# Altium schematic sheet S01.SchDoc: DQLA-F   FPGA Interface Board
size 381 x 254 mm; Revision: 1.1; SheetNumber: 1; SheetTotal: 1
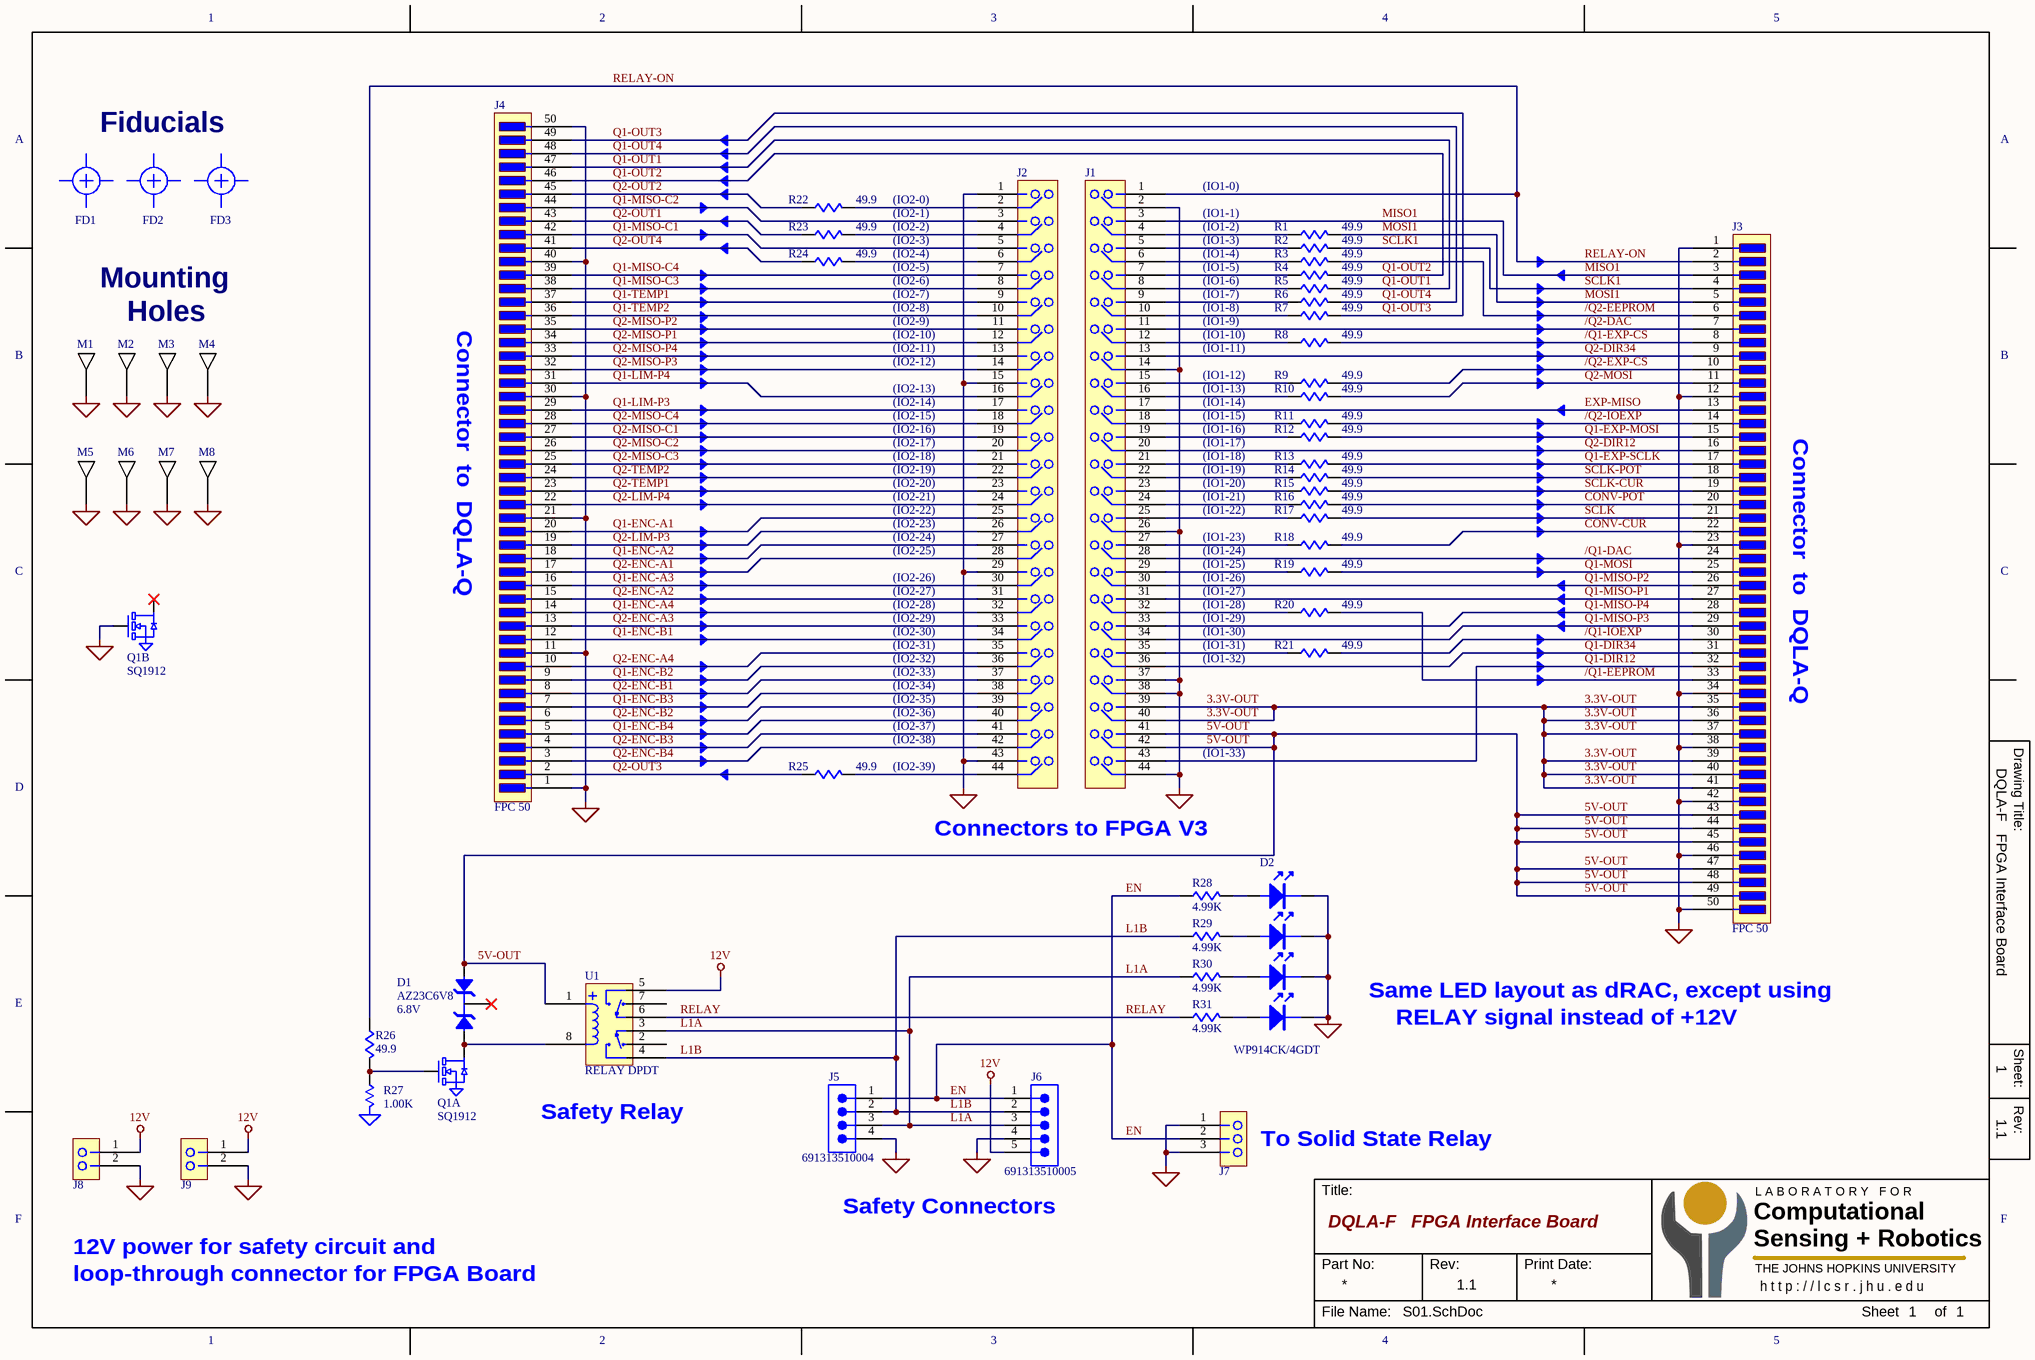
[diagram p0: S01.SchDoc]

## Parts
D1  AZ23C6V8  Voltage: 6.8V  [SOT-23]
D2  WP914CK/4GDT  [LED-3MM-QUAD]
FD1  FD  [FD]  (value not drawn)  (no BOM)
FD2  FD  [FD]  (value not drawn)  (no BOM)
FD3  FD  [FD]  (value not drawn)  (no BOM)
J1  HEADER 22x2-1  [HDR-22x2-2MM]  (value not drawn)
J2  HEADER 22x2-1  [HDR-22x2-2MM]  (value not drawn)
J3  FPC 50  [CONN-XF3M1-5015-1B-REV]
J4  FPC 50  [CONN-XF3M1-5015-1B-REV]
J5  691313510004  [691313510004]
J6  691313510005  [691313510005]
J7  HEADER 3  [HDR-3x1-100]  (value not drawn)
J8  HEADER 2  [HDR-2x1-100]  (value not drawn)
J9  HEADER 2  [HDR-2x1-100]  (value not drawn)
M1  MHOLE  [MHOLE4]  (value not drawn)  (no BOM)
M2  MHOLE  [MHOLE4]  (value not drawn)  (no BOM)
M3  MHOLE  [MHOLE4]  (value not drawn)  (no BOM)
M4  MHOLE  [MHOLE4]  (value not drawn)  (no BOM)
M5  MHOLE  [MHOLE4]  (value not drawn)  (no BOM)
M6  MHOLE  [MHOLE4]  (value not drawn)  (no BOM)
M7  MHOLE  [MHOLE4]  (value not drawn)  (no BOM)
M8  MHOLE  [MHOLE4]  (value not drawn)  (no BOM)
Q1  SQ1912  [SC70-6-NP]  (parts A,B of 2)
R1  49.9  [R0402]
R2  49.9  [R0402]
R3  49.9  [R0402]
R4  49.9  [R0402]
R5  49.9  [R0402]
R6  49.9  [R0402]
R7  49.9  [R0402]
R8  49.9  [R0402]
R9  49.9  [R0402]
R10  49.9  [R0402]
R11  49.9  [R0402]
R12  49.9  [R0402]
R13  49.9  [R0402]
R14  49.9  [R0402]
R15  49.9  [R0402]
R16  49.9  [R0402]
R17  49.9  [R0402]
R18  49.9  [R0402]
R19  49.9  [R0402]
R20  49.9  [R0402]
R21  49.9  [R0402]
R22  49.9  [R0402]
R23  49.9  [R0402]
R24  49.9  [R0402]
R25  49.9  [R0402]
R26  49.9  [R0402]
R27  1.00K  [R0402]
R28  4.99K  [R0402]
R29  4.99K  [R0402]
R30  4.99K  [R0402]
R31  4.99K  [R0402]
U1  RELAY DPDT  [RELAY-IM03TS]

## Nets
12V: J6.5 J8.1 J9.1 U1.5(NO)
GND: D2.1(C) D2.3(C) D2.5(C) D2.7(C) J1.2 J1.14 J1.26 J1.37 J1.38 J1.44 J2.1 J2.15 J2.29 J2.43 J3.1 J3.12 J3.23 J3.34 J3.38 J3.42 J3.46 J3.50 J4.1 J4.11 J4.21 J4.30 J4.40 J4.50 J5.4 J6.4 J7.1 J7.3 J8.2 J9.2 M1.1 M2.1 M3.1 M4.1 M5.1 M6.1 M7.1 M8.1 Q1.1(S1) Q1.4(S2) Q1.5(G2) R27.2(GND)
3.3V-OUT: J1.39 J1.40 J3.35 J3.36 J3.37 J3.39 J3.40 J3.41
5V-OUT: D1.1(A2) J1.41 J1.42 J3.43 J3.44 J3.45 J3.47 J3.48 J3.49 U1.1(COIL+)
/Q1-DAC: J1.28 J3.24
/Q1-EEPROM: J3.33 R20.2
/Q1-EXP-CS: J3.8 R8.2
/Q1-IOEXP: J3.30 R21.2
/Q2-DAC: J1.11 J3.7
/Q2-EEPROM: J3.6 R3.2
/Q2-EXP-CS: J3.10 R9.2
/Q2-IOEXP: J3.14 R11.2
CONV-CUR: J3.22 R18.2
CONV-POT: J3.20 R16.2
EN: J5.1 J6.1 J7.2 R28.1
EXP-MISO: J1.17 J3.13
L1A: J5.3 J6.3 R30.1 U1.3(COM)
L1B: J5.2 J6.2 R29.1 U1.4(NO)
MISO1: J1.3 J3.3
MOSI1: J3.5 R1.2
Q1-DIR12: J1.43 J3.32
Q1-DIR34: J1.36 J3.31
Q1-ENC-A1: J2.25 J4.20
Q1-ENC-A2: J2.27 J4.18
Q1-ENC-A3: J2.30 J4.16
Q1-ENC-A4: J2.32 J4.14
Q1-ENC-B1: J2.34 J4.12
Q1-ENC-B2: J2.36 J4.9
Q1-ENC-B3: J2.38 J4.7
Q1-ENC-B4: J2.40 J4.5
Q1-EXP-MOSI: J3.15 R12.2
Q1-EXP-SCLK: J3.17 R13.2
Q1-LIM-P3: J2.17 J4.29
Q1-LIM-P4: J2.16 J4.31
Q1-MISO-C1: J2.5 J4.42
Q1-MISO-C2: J2.3 J4.44
Q1-MISO-C3: J2.8 J4.38
Q1-MISO-C4: J2.7 J4.39
Q1-MISO-P1: J1.31 J3.27
Q1-MISO-P2: J1.30 J3.26
Q1-MISO-P3: J1.34 J3.29
Q1-MISO-P4: J1.33 J3.28
Q1-MOSI: J3.25 R19.2
Q1-OUT1: J4.47 R5.2
Q1-OUT2: J4.46 R4.2
Q1-OUT3: J4.49 R7.2
Q1-OUT4: J4.48 R6.2
Q1-TEMP1: J2.9 J4.37
Q1-TEMP2: J2.10 J4.36
Q2-DIR12: J1.20 J3.16
Q2-DIR34: J1.13 J3.9
Q2-ENC-A1: J2.28 J4.17
Q2-ENC-A2: J2.31 J4.15
Q2-ENC-A3: J2.33 J4.13
Q2-ENC-A4: J2.35 J4.10
Q2-ENC-B1: J2.37 J4.8
Q2-ENC-B2: J2.39 J4.6
Q2-ENC-B3: J2.41 J4.4
Q2-ENC-B4: J2.42 J4.3
Q2-LIM-P3: J2.26 J4.19
Q2-LIM-P4: J2.24 J4.22
Q2-MISO-C1: J2.19 J4.27
Q2-MISO-C2: J2.20 J4.26
Q2-MISO-C3: J2.21 J4.25
Q2-MISO-C4: J2.18 J4.28
Q2-MISO-P1: J2.12 J4.34
Q2-MISO-P2: J2.11 J4.35
Q2-MISO-P3: J2.14 J4.32
Q2-MISO-P4: J2.13 J4.33
Q2-MOSI: J3.11 R10.2
Q2-OUT1: J4.43 R23.1
Q2-OUT2: J4.45 R22.1
Q2-OUT3: J4.2 R25.1
Q2-OUT4: J4.41 R24.1
Q2-TEMP1: J2.23 J4.23
Q2-TEMP2: J2.22 J4.24
RELAY: R31.1 U1.6(COM)
RELAY-ON: J1.1 J3.2 R26.1
SCLK: J3.21 R17.2
SCLK1: J3.4 R2.2
SCLK-CUR: J3.19 R15.2
SCLK-POT: J3.18 R14.2
NetD1_2: D1.2(A1) Q1.6(D1) U1.8(COIL-)
NetD2_2: D2.2(A) R28.2
NetD2_4: D2.4(A) R29.2
NetD2_6: D2.6(A) R30.2
NetD2_8: D2.8(A) R31.2
NetJ1_4: J1.4 R1.1
NetJ1_5: J1.5 R2.1
NetJ1_6: J1.6 R3.1
NetJ1_7: J1.7 R4.1
NetJ1_8: J1.8 R5.1
NetJ1_9: J1.9 R6.1
NetJ1_10: J1.10 R7.1
NetJ1_12: J1.12 R8.1
NetJ1_15: J1.15 R9.1
NetJ1_16: J1.16 R10.1
NetJ1_18: J1.18 R11.1
NetJ1_19: J1.19 R12.1
NetJ1_21: J1.21 R13.1
NetJ1_22: J1.22 R14.1
NetJ1_23: J1.23 R15.1
NetJ1_24: J1.24 R16.1
NetJ1_25: J1.25 R17.1
NetJ1_27: J1.27 R18.1
NetJ1_29: J1.29 R19.1
NetJ1_32: J1.32 R20.1
NetJ1_35: J1.35 R21.1
NetJ2_2: J2.2 R22.2
NetJ2_4: J2.4 R23.2
NetJ2_6: J2.6 R24.2
NetJ2_44: J2.44 R25.2
NetQ1_2: Q1.2(G1) R26.2 R27.1

Not connected (* = marked no-connect by the designer): D1 3(A1)*; Q1 3(D2)*; U1 2(NC) 7(NC)

## Notes on the sheet
- Fiducials
- (IO2-0)
- (IO2-1)
- (IO2-2)
- (IO1-0)
- (IO1-1)
- (IO1-2)
- Mounting
- (IO2-3)
- (IO2-4)
- (IO2-5)
- (IO2-6)
- (IO2-7)
- (IO1-3)
- (IO1-4)
- (IO1-5)
- (IO1-6)
- (IO1-7)
- Holes
- (IO2-8)
- (IO2-9)
- (IO2-10)
- (IO2-11)
- (IO2-12)
- (IO1-8)
- (IO1-9)
- (IO1-10)
- (IO1-11)
- (IO2-13)
- (IO2-14)
- (IO2-15)
- (IO2-16)
- (IO1-12)
- (IO1-13)
- (IO1-14)
- (IO1-15)
- (IO1-16)
- Connector  to  DQLA-Q
- (IO2-17)
- (IO2-18)
- (IO2-19)
- (IO2-20)
- (IO2-21)
- (IO1-17)
- (IO1-18)
- (IO1-19)
- (IO1-20)
- (IO1-21)
- (IO2-22)
- (IO2-23)
- (IO2-24)
- (IO2-25)
- (IO1-22)
- (IO1-23)
- (IO1-24)
- (IO1-25)
- (IO2-26)
- (IO2-27)
- (IO2-28)
- (IO2-29)
- (IO2-30)
- (IO1-26)
- (IO1-27)
- (IO1-28)
- (IO1-29)
- (IO1-30)
- (IO2-31)
- (IO2-32)
- (IO2-33)
- (IO2-34)
- (IO2-35)
- (IO1-31)
- (IO1-32)
- (IO2-36)
- (IO2-37)
- (IO2-38)
- (IO2-39)
- (IO1-33)
- Connectors to FPGA V3
- Same LED layout as dRAC, except using
- RELAY signal instead of +12V
- (near U1) Safety Relay
- (near J7) To Solid State Relay
- 12V power for safety circuit and
- Could add LED for /RELAY (might be useful for debugging)
- Safety Connectors
- loop-through connector for FPGA Board
- 1
- 2
- 3
- 4
- 5
- A
- B
- C
- Drawing Title:
- D
- E
- Sheet:
- Rev:
- F
- Title:
- Computational
- Sensing + Robotics
- L A B O R A T O R Y   F O R
- Part No:
- Print Date:
- THE JOHNS HOPKINS UNIVERSITY
- h t t p : / / l c s r . j h u . e d u
- File Name:
- Sheet
- of

## Library data of the parts
D1 = ZENER-DUAL-CC
D2 = LED-QUAD
J5 = 691313510004: WR-TBL Series 313 Close Horizontal PCB Header, THT, pitch 5.08mm, 4p; Manufacturer: Wurth Elektronik; Modularity: No; Rated Current: 20A; Working Voltage: 300V; ComponentLink1Description: Website Link; ComponentLink1URL: https://www.we-online.com/redexpert/article/691313510004?ad; ComponentLink2Description: Datasheet Link; ComponentLink2URL: https://www.we-online.com/redexpert/spec/691313510004?ad; Manufacturer Part Number: 691313510004; Category: Terminal Blocks; Match Code: WR-TBL; Mount: Through Hole; Operating Temperature Max: 105°C; Operating Temperature Min: -40°C; Packaging: Box; Application: Pluggable; Number of Pins: 4; Number of Rows: 1; Orientation: Horizontal; Pitch: 5.08mm
J6 = 691313510005: WR-TBL Series 313 Close Horizontal PCB Header, THT, pitch 5.08mm, 5p; Manufacturer: Wurth Elektronik; Modularity: No; Rated Current: 20A; Working Voltage: 300V; ComponentLink1Description: Website Link; ComponentLink1URL: https://www.we-online.com/redexpert/article/691313510005?ad; ComponentLink2Description: Datasheet Link; ComponentLink2URL: https://www.we-online.com/redexpert/spec/691313510005?ad; Manufacturer Part Number: 691313510005; Category: Terminal Blocks; Match Code: WR-TBL; Mount: Through Hole; Operating Temperature Max: 105°C; Operating Temperature Min: -40°C; Packaging: Box; Application: Pluggable; Number of Pins: 5; Number of Rows: 1; Orientation: Horizontal; Pitch: 5.08mm
M1-M8 = MHOLE: Mounting Hole
Q1 = MOSFET-N-DUAL6
R1-R26 R28-R31 = R
R27 = R-GND